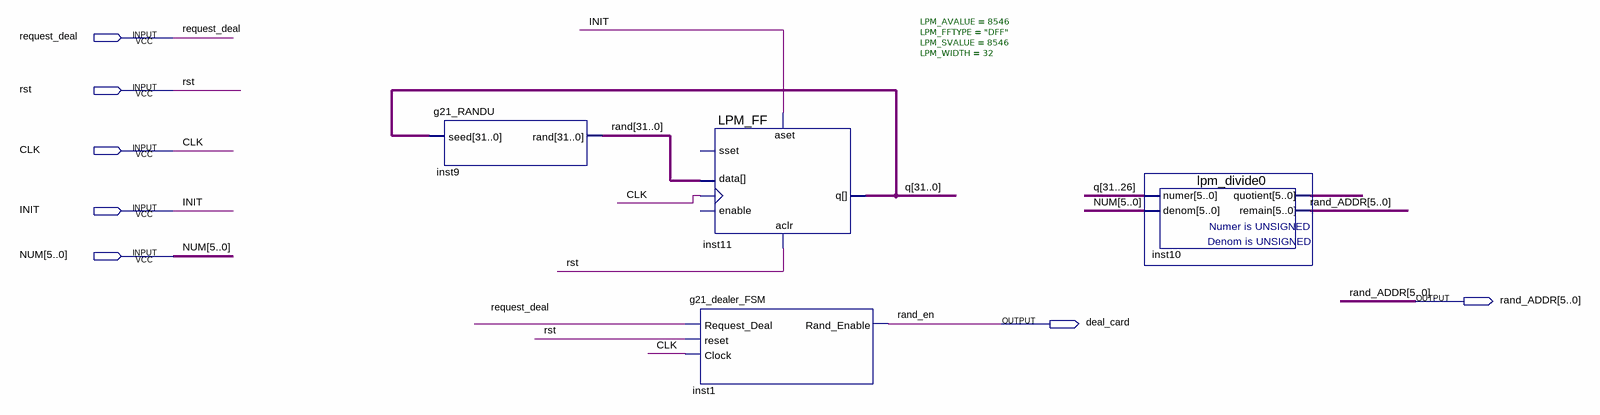
[diagram p0: schematic sheet]
// Quartus schematic random_address_gen.bdf as structural Verilog: 4 symbols, 7 pins
module random_address_gen (
  input  request_deal,
  input  rst,
  input  CLK,
  input  INIT,
  input  [5:0] NUM,
  output [5:0] rand_ADDR,
  output deal_card
);

  wire [5:0] inst10_quotient;
  wire [31:0] q, \rand ;

  g21_RANDU inst9 (.seed(q), .\rand (\rand ));
  LPM_FF #(.LPM_AVALUE(8546), .LPM_FFTYPE("DFF"), .LPM_SVALUE(8546), .LPM_WIDTH(32)) inst11 (
    .aclr(rst), .aset(INIT), .clock(CLK), .data(\rand ), .q(q));  // open: enable, sset
  g21_dealer_FSM inst1 (.Request_Deal(request_deal), .reset(rst), .Clock(CLK), .Rand_Enable(deal_card));
  lpm_divide0 inst10 (.numer(q[31:26]), .denom(NUM), .quotient(inst10_quotient), .remain(rand_ADDR));

  // Other names for the same wires on the sheet: rand_en = deal_card
endmodule
